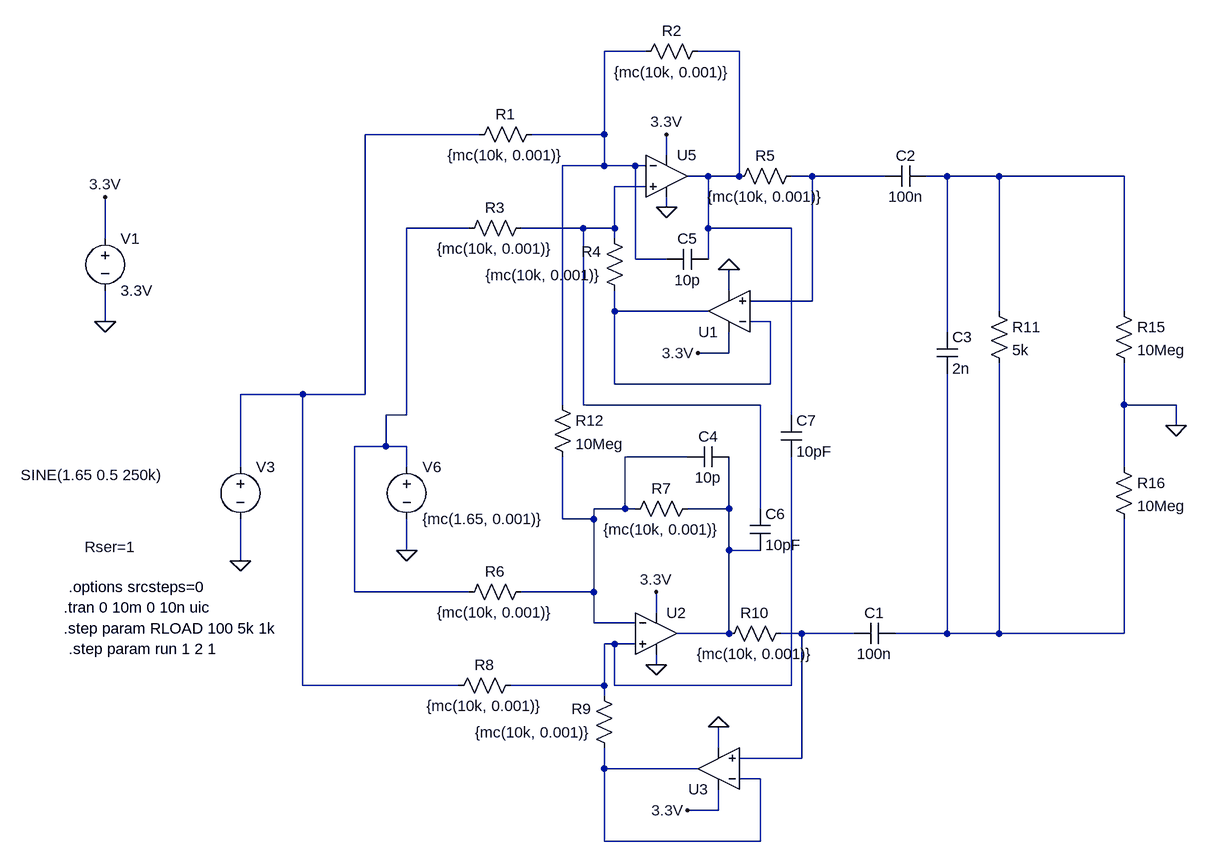
[diagram p0: schematic Mirrored EHCP - Ideal OpAmp.asc]
Mirrored EHCP - Ideal OpAmp.asc, the LTspice schematic file:
Version 4
SHEET 1 1248 1180
WIRE 160 -48 96 -48
WIRE 304 -48 240 -48
WIRE -96 80 -272 80
WIRE 96 80 96 -48
WIRE 96 80 -16 80
WIRE 192 112 192 80
WIRE 96 128 96 80
WIRE 96 128 32 128
WIRE 144 128 96 128
WIRE 160 128 144 128
WIRE 256 144 224 144
WIRE 304 144 304 -48
WIRE 304 144 256 144
WIRE 416 144 384 144
WIRE 528 144 416 144
WIRE 624 144 592 144
WIRE 704 144 624 144
WIRE 896 144 704 144
WIRE 160 160 112 160
WIRE 192 192 192 176
WIRE -112 224 -208 224
WIRE 64 224 -32 224
WIRE 112 224 112 160
WIRE 112 224 64 224
WIRE 256 224 256 144
WIRE 384 224 256 224
WIRE -672 240 -672 176
WIRE 112 240 112 224
WIRE 144 272 144 128
WIRE 192 272 144 272
WIRE 256 272 256 224
WIRE 288 320 288 288
WIRE 416 336 416 144
WIRE 416 336 320 336
WIRE 112 352 112 320
WIRE 256 352 112 352
WIRE 704 352 704 144
WIRE 896 352 896 144
WIRE -672 368 -672 320
WIRE 352 368 320 368
WIRE 624 384 624 144
WIRE 288 416 288 384
WIRE 288 416 240 416
WIRE 112 464 112 352
WIRE 352 464 352 368
WIRE 352 464 112 464
WIRE -368 480 -464 480
WIRE -272 480 -272 80
WIRE -272 480 -368 480
WIRE 32 496 32 128
WIRE 64 496 64 224
WIRE 336 496 64 496
WIRE 896 496 896 432
WIRE 976 496 896 496
WIRE -208 512 -208 224
WIRE -208 512 -240 512
WIRE 384 512 384 224
WIRE 976 528 976 496
WIRE -240 560 -240 512
WIRE -240 560 -288 560
WIRE -208 560 -240 560
WIRE 224 576 128 576
WIRE -464 592 -464 480
WIRE -208 592 -208 560
WIRE 896 592 896 496
WIRE 128 656 128 576
WIRE 128 656 80 656
WIRE 144 656 128 656
WIRE 288 656 288 576
WIRE 288 656 224 656
WIRE 336 656 336 496
WIRE 32 672 32 576
WIRE 80 672 80 656
WIRE 80 672 32 672
WIRE -208 720 -208 672
WIRE 288 720 288 656
WIRE 336 720 288 720
WIRE -464 736 -464 672
WIRE -288 784 -288 560
WIRE -112 784 -288 784
WIRE 80 784 80 672
WIRE 80 784 -32 784
WIRE 176 816 176 784
WIRE 80 832 80 784
WIRE 144 832 80 832
WIRE 288 848 288 720
WIRE 288 848 208 848
WIRE 400 848 368 848
WIRE 480 848 400 848
WIRE 624 848 624 448
WIRE 624 848 544 848
WIRE 704 848 704 432
WIRE 704 848 624 848
WIRE 896 848 896 672
WIRE 896 848 704 848
WIRE 112 864 96 864
WIRE 144 864 112 864
WIRE 176 896 176 880
WIRE -368 928 -368 480
WIRE -128 928 -368 928
WIRE 96 928 96 864
WIRE 96 928 -48 928
WIRE 112 928 112 864
WIRE 384 928 384 576
WIRE 384 928 112 928
WIRE 96 944 96 928
WIRE 272 1024 272 992
WIRE 400 1040 400 848
WIRE 400 1040 304 1040
WIRE 96 1056 96 1024
WIRE 240 1056 96 1056
WIRE 336 1072 304 1072
WIRE 272 1120 272 1088
WIRE 272 1120 224 1120
WIRE 96 1168 96 1056
WIRE 336 1168 336 1072
WIRE 336 1168 96 1168
FLAG 192 192 0
FLAG -672 368 0
FLAG -672 176 3.3V
FLAG 288 288 0
FLAG 192 80 3.3V
FLAG 240 416 3.3V
FLAG -464 736 0
FLAG 176 896 0
FLAG 272 992 0
FLAG 176 784 3.3V
FLAG 224 1120 3.3V
FLAG -208 720 0
FLAG 976 528 0
SYMBOL voltage -672 224 R0
WINDOW 123 0 0 Left 0
WINDOW 39 0 0 Left 0
SYMATTR InstName V1
SYMATTR Value 3.3V
SYMBOL voltage -464 576 R0
WINDOW 3 -338 28 Left 2
WINDOW 123 0 0 Left 0
WINDOW 39 -240 139 Left 2
SYMATTR Value SINE(1.65 0.5 250k)
SYMATTR SpiceLine Rser=1
SYMATTR InstName V3
SYMBOL res 0 64 R90
WINDOW 0 0 56 VBottom 2
WINDOW 3 32 56 VTop 2
SYMATTR InstName R1
SYMATTR Value {mc(10k, 0.001)}
SYMBOL res 256 -64 R90
WINDOW 0 0 56 VBottom 2
WINDOW 3 32 56 VTop 2
SYMATTR InstName R2
SYMATTR Value {mc(10k, 0.001)}
SYMBOL res -16 208 R90
WINDOW 0 0 56 VBottom 2
WINDOW 3 32 56 VTop 2
SYMATTR InstName R3
SYMATTR Value {mc(10k, 0.001)}
SYMBOL res 128 336 R180
WINDOW 0 36 76 Left 2
WINDOW 3 36 40 Left 2
SYMATTR InstName R4
SYMATTR Value {mc(10k, 0.001)}
SYMBOL res 400 128 R90
WINDOW 0 0 56 VBottom 2
WINDOW 3 32 56 VTop 2
SYMATTR InstName R5
SYMATTR Value {mc(10k, 0.001)}
SYMBOL cap 592 128 R90
WINDOW 0 0 32 VBottom 2
WINDOW 3 32 32 VTop 2
SYMATTR InstName C2
SYMATTR Value 100n
SYMBOL res 688 336 R0
SYMATTR InstName R11
SYMATTR Value 5k
SYMBOL OpAmps\\UniversalOpAmp1 192 144 R0
SYMATTR InstName U5
SYMATTR Value2 Avol=1Meg GBW=10Meg Vos={mc(0,125u)}
SYMBOL OpAmps\\UniversalOpAmp1 288 352 R180
SYMATTR InstName U1
SYMATTR Value2 Avol=1Meg GBW=10Meg Vos={mc(0,125u)}
SYMBOL res -16 768 R90
WINDOW 0 0 56 VBottom 2
WINDOW 3 32 56 VTop 2
SYMATTR InstName R6
SYMATTR Value {mc(10k, 0.001)}
SYMBOL res 240 640 R90
WINDOW 0 0 56 VBottom 2
WINDOW 3 32 56 VTop 2
SYMATTR InstName R7
SYMATTR Value {mc(10k, 0.001)}
SYMBOL res -32 912 R90
WINDOW 0 0 56 VBottom 2
WINDOW 3 32 56 VTop 2
SYMATTR InstName R8
SYMATTR Value {mc(10k, 0.001)}
SYMBOL res 112 1040 R180
WINDOW 0 36 76 Left 2
WINDOW 3 36 40 Left 2
SYMATTR InstName R9
SYMATTR Value {mc(10k, 0.001)}
SYMBOL res 384 832 R90
WINDOW 0 0 56 VBottom 2
WINDOW 3 32 56 VTop 2
SYMATTR InstName R10
SYMATTR Value {mc(10k, 0.001)}
SYMBOL OpAmps\\UniversalOpAmp1 176 848 R0
SYMATTR InstName U2
SYMATTR Value2 Avol=1Meg GBW=10Meg Vos={mc(0,125u)}
SYMBOL OpAmps\\UniversalOpAmp1 272 1056 R180
SYMATTR InstName U3
SYMATTR Value2 Avol=1Meg GBW=10Meg Vos={mc(0,125u)}
SYMBOL cap 544 832 R90
WINDOW 0 0 32 VBottom 2
WINDOW 3 32 32 VTop 2
SYMATTR InstName C1
SYMATTR Value 100n
SYMBOL cap 608 384 R0
SYMATTR InstName C3
SYMATTR Value 2n
SYMBOL voltage -208 576 R0
WINDOW 123 0 0 Left 0
WINDOW 39 0 0 Left 0
SYMATTR InstName V6
SYMATTR Value {mc(1.65, 0.001)}
SYMBOL res 16 480 R0
SYMATTR InstName R12
SYMATTR Value 10Meg
SYMBOL cap 288 560 R90
WINDOW 0 0 32 VBottom 2
WINDOW 3 32 32 VTop 2
SYMATTR InstName C4
SYMATTR Value 10p
SYMBOL cap 256 256 R90
WINDOW 0 0 32 VBottom 2
WINDOW 3 32 32 VTop 2
SYMATTR InstName C5
SYMATTR Value 10p
SYMBOL cap 320 656 R0
SYMATTR InstName C6
SYMATTR Value 10pF
SYMBOL res 880 336 R0
SYMATTR InstName R15
SYMATTR Value 10Meg
SYMBOL res 880 576 R0
SYMATTR InstName R16
SYMATTR Value 10Meg
SYMBOL cap 368 512 R0
SYMATTR InstName C7
SYMATTR Value 10pF
TEXT -736 808 Left 2 !.tran 0 10m 0 10n uic
TEXT -728 776 Left 2 !.options srcsteps=0
TEXT -736 840 Left 2 !.step param RLOAD 100 5k 1k
TEXT -728 872 Left 2 !.step param run 1 2 1

The netlist it stands for:
* Mirrored EHCP - Ideal OpAmp.asc
V1 3.3V 0 3.3V
V3 N003 0 SINE(1.65 0.5 250k) Rser=1
R1 N001 N003 {mc(10k, 0.001)}
R2 N002 N001 {mc(10k, 0.001)}
R3 N006 N007 {mc(10k, 0.001)}
R4 N008 N006 {mc(10k, 0.001)}
R5 N004 N002 {mc(10k, 0.001)}
C2 N005 N004 100n
R11 N005 N012 5k
XU5 N006 N001 3.3V 0 N002 level1 Avol=1Meg GBW=10Meg Vos={mc(0,125u)} En=0 Enk=0 In=0 Ink=0 Rin=500Meg  ; pins In+ In- V+ V- OUT
XU1 N004 N008 3.3V 0 N008 level1 Avol=1Meg GBW=10Meg Vos={mc(0,125u)} En=0 Enk=0 In=0 Ink=0 Rin=500Meg  ; pins In+ In- V+ V- OUT
R6 N009 N007 {mc(10k, 0.001)}
R7 N010 N009 {mc(10k, 0.001)}
R8 N013 N003 {mc(10k, 0.001)}
R9 N014 N013 {mc(10k, 0.001)}
R10 N011 N010 {mc(10k, 0.001)}
XU2 N013 N009 3.3V 0 N010 level1 Avol=1Meg GBW=10Meg Vos={mc(0,125u)} En=0 Enk=0 In=0 Ink=0 Rin=500Meg  ; pins In+ In- V+ V- OUT
XU3 N011 N014 3.3V 0 N014 level1 Avol=1Meg GBW=10Meg Vos={mc(0,125u)} En=0 Enk=0 In=0 Ink=0 Rin=500Meg  ; pins In+ In- V+ V- OUT
C1 N012 N011 100n
C3 N005 N012 2n
V6 N007 0 {mc(1.65, 0.001)}
R12 N001 N009 10Meg
C4 N010 N009 10p
C5 N002 N001 10p
C6 N006 N010 10pF
R15 N005 0 10Meg
R16 0 N012 10Meg
C7 N002 N013 10pF
.tran 0 10m 0 10n uic
.options srcsteps=0
.step param RLOAD 100 5k 1k
.step param run 1 2 1
.lib UniversalOpAmp1.lib
.backanno
.end